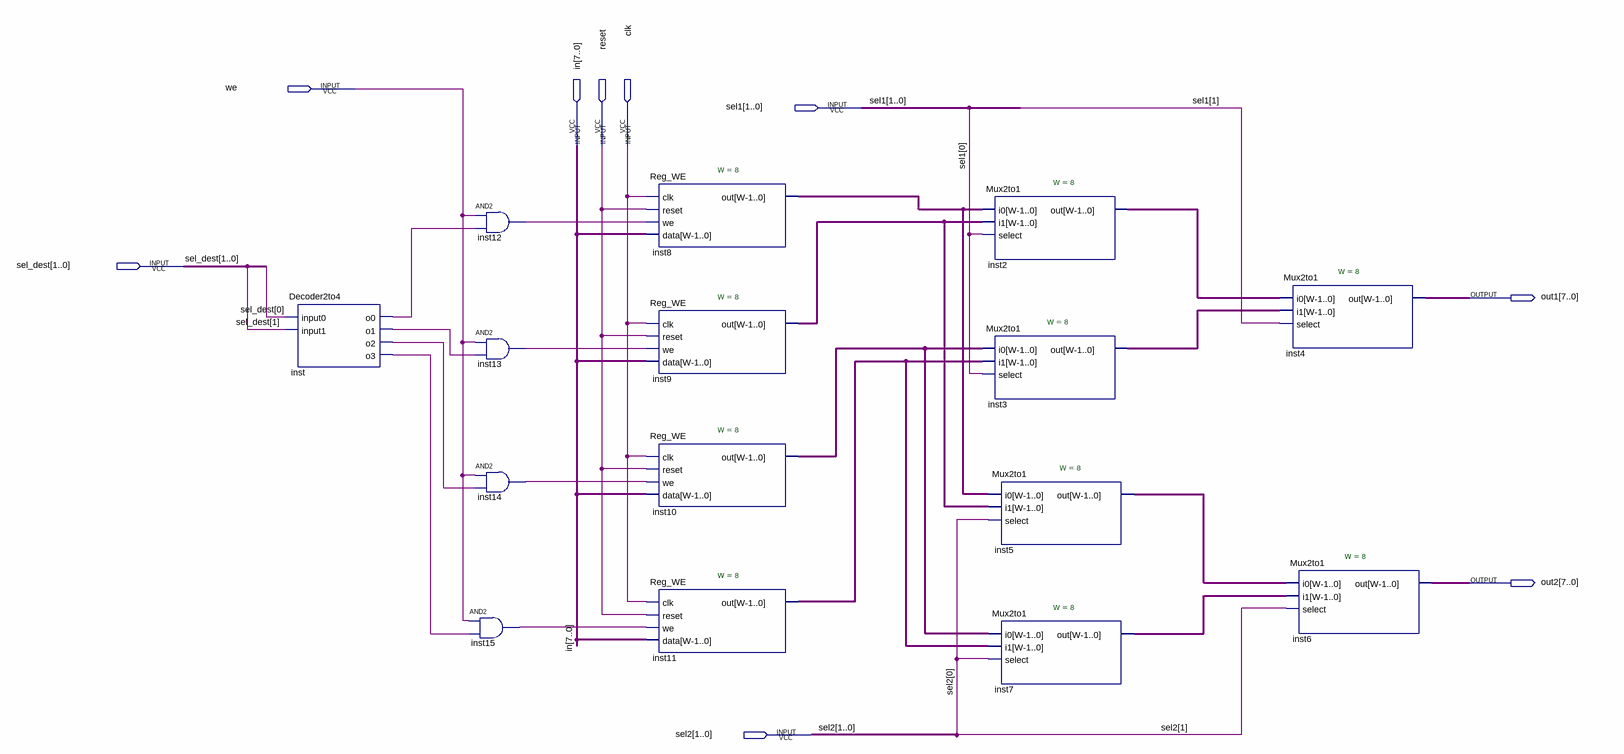
[diagram p0: schematic sheet]
// Quartus schematic lab1_registerfile.bdf as structural Verilog: 15 symbols, 9 pins
module lab1_registerfile (
  input  we,
  input  [1:0] sel1,
  input  [7:0] in,
  input  reset,
  input  clk,
  input  [1:0] sel_dest,
  input  [1:0] sel2,
  output [7:0] out1,
  output [7:0] out2
);

  wire inst12_out, inst13_out, inst14_out, inst15_out, inst_o0, inst_o1, inst_o2, inst_o3;
  wire [7:0] inst2_out, inst3_out, inst5_out, inst7_out, inst8_out, inst9_out, inst10_out, inst11_out;

  Decoder2to4 inst (.input0(sel_dest[0]), .input1(sel_dest[1]), .o0(inst_o0), .o1(inst_o1), .o2(inst_o2), .o3(inst_o3));
  and inst12 (inst12_out, we, inst_o0);
  and inst13 (inst13_out, we, inst_o1);
  and inst14 (inst14_out, we, inst_o2);
  and inst15 (inst15_out, we, inst_o3);
  Reg_WE #(.W(8)) inst8 (.clk(clk), .reset(reset), .we(inst12_out), .data(in), .out(inst8_out));
  Reg_WE #(.W(8)) inst9 (.clk(clk), .reset(reset), .we(inst13_out), .data(in), .out(inst9_out));
  Reg_WE #(.W(8)) inst10 (.clk(clk), .reset(reset), .we(inst14_out), .data(in), .out(inst10_out));
  Reg_WE #(.W(8)) inst11 (.clk(clk), .reset(reset), .we(inst15_out), .data(in), .out(inst11_out));
  Mux2to1 #(.W(8)) inst2 (.i0(inst8_out), .i1(inst9_out), .select(sel1[0]), .out(inst2_out));
  Mux2to1 #(.W(8)) inst3 (.i0(inst10_out), .i1(inst11_out), .select(sel1[0]), .out(inst3_out));
  Mux2to1 #(.W(8)) inst5 (.i0(inst8_out), .i1(inst9_out), .select(sel2[0]), .out(inst5_out));
  Mux2to1 #(.W(8)) inst7 (.i0(inst10_out), .i1(inst11_out), .select(sel2[0]), .out(inst7_out));
  Mux2to1 #(.W(8)) inst4 (.i0(inst2_out), .i1(inst3_out), .select(sel1[1]), .out(out1));
  Mux2to1 #(.W(8)) inst6 (.i0(inst5_out), .i1(inst7_out), .select(sel2[1]), .out(out2));
endmodule
